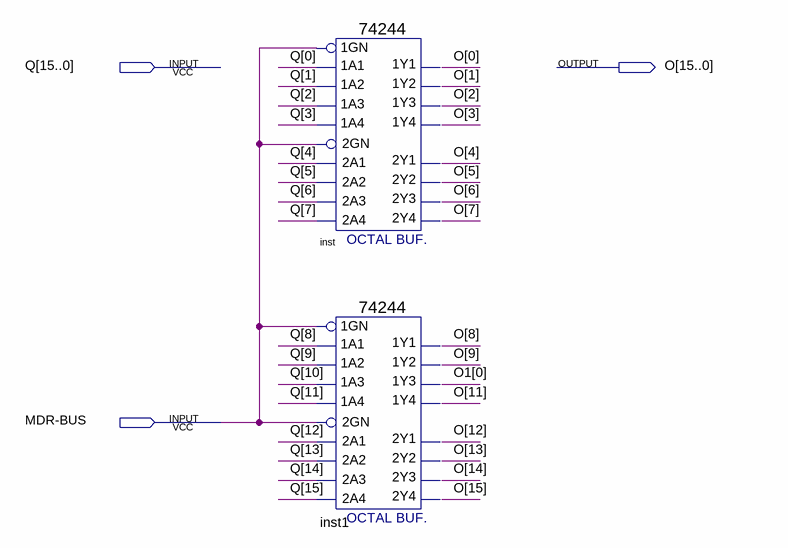
[diagram p0: schematic sheet]
// Quartus schematic Memory_MDR_tri.bdf as structural Verilog: 2 symbols, 3 pins
module Memory_MDR_tri (
  input  [15:0] Q,
  input  \MDR-BUS ,
  output [15:0] O
);

  wire [0:0] O1;

  \74244  inst (
    .\1A2 (Q[1]), .\1A4 (Q[3]), .\1A1 (Q[0]), .\1A3 (Q[2]), .\1GN (\MDR-BUS ), .\2A3 (Q[6]),
    .\2GN (\MDR-BUS ), .\2A1 (Q[4]), .\2A4 (Q[7]), .\2A2 (Q[5]), .\1Y2 (O[1]), .\1Y4 (O[3]), .\2Y1 (O[4]),
    .\1Y1 (O[0]), .\2Y3 (O[6]), .\2Y4 (O[7]), .\1Y3 (O[2]), .\2Y2 (O[5]));
  \74244  inst1 (
    .\1A2 (Q[9]), .\1A4 (Q[11]), .\1A1 (Q[8]), .\1A3 (Q[10]), .\1GN (\MDR-BUS ), .\2A3 (Q[14]),
    .\2GN (\MDR-BUS ), .\2A1 (Q[12]), .\2A4 (Q[15]), .\2A2 (Q[13]), .\1Y2 (O[9]), .\1Y4 (O[11]),
    .\2Y1 (O[12]), .\1Y1 (O[8]), .\2Y3 (O[14]), .\2Y4 (O[15]), .\1Y3 (O1[0]), .\2Y2 (O[13]));
endmodule
